# EAGLE design zOUT_fp_00a (EAGLE 6.5.0)
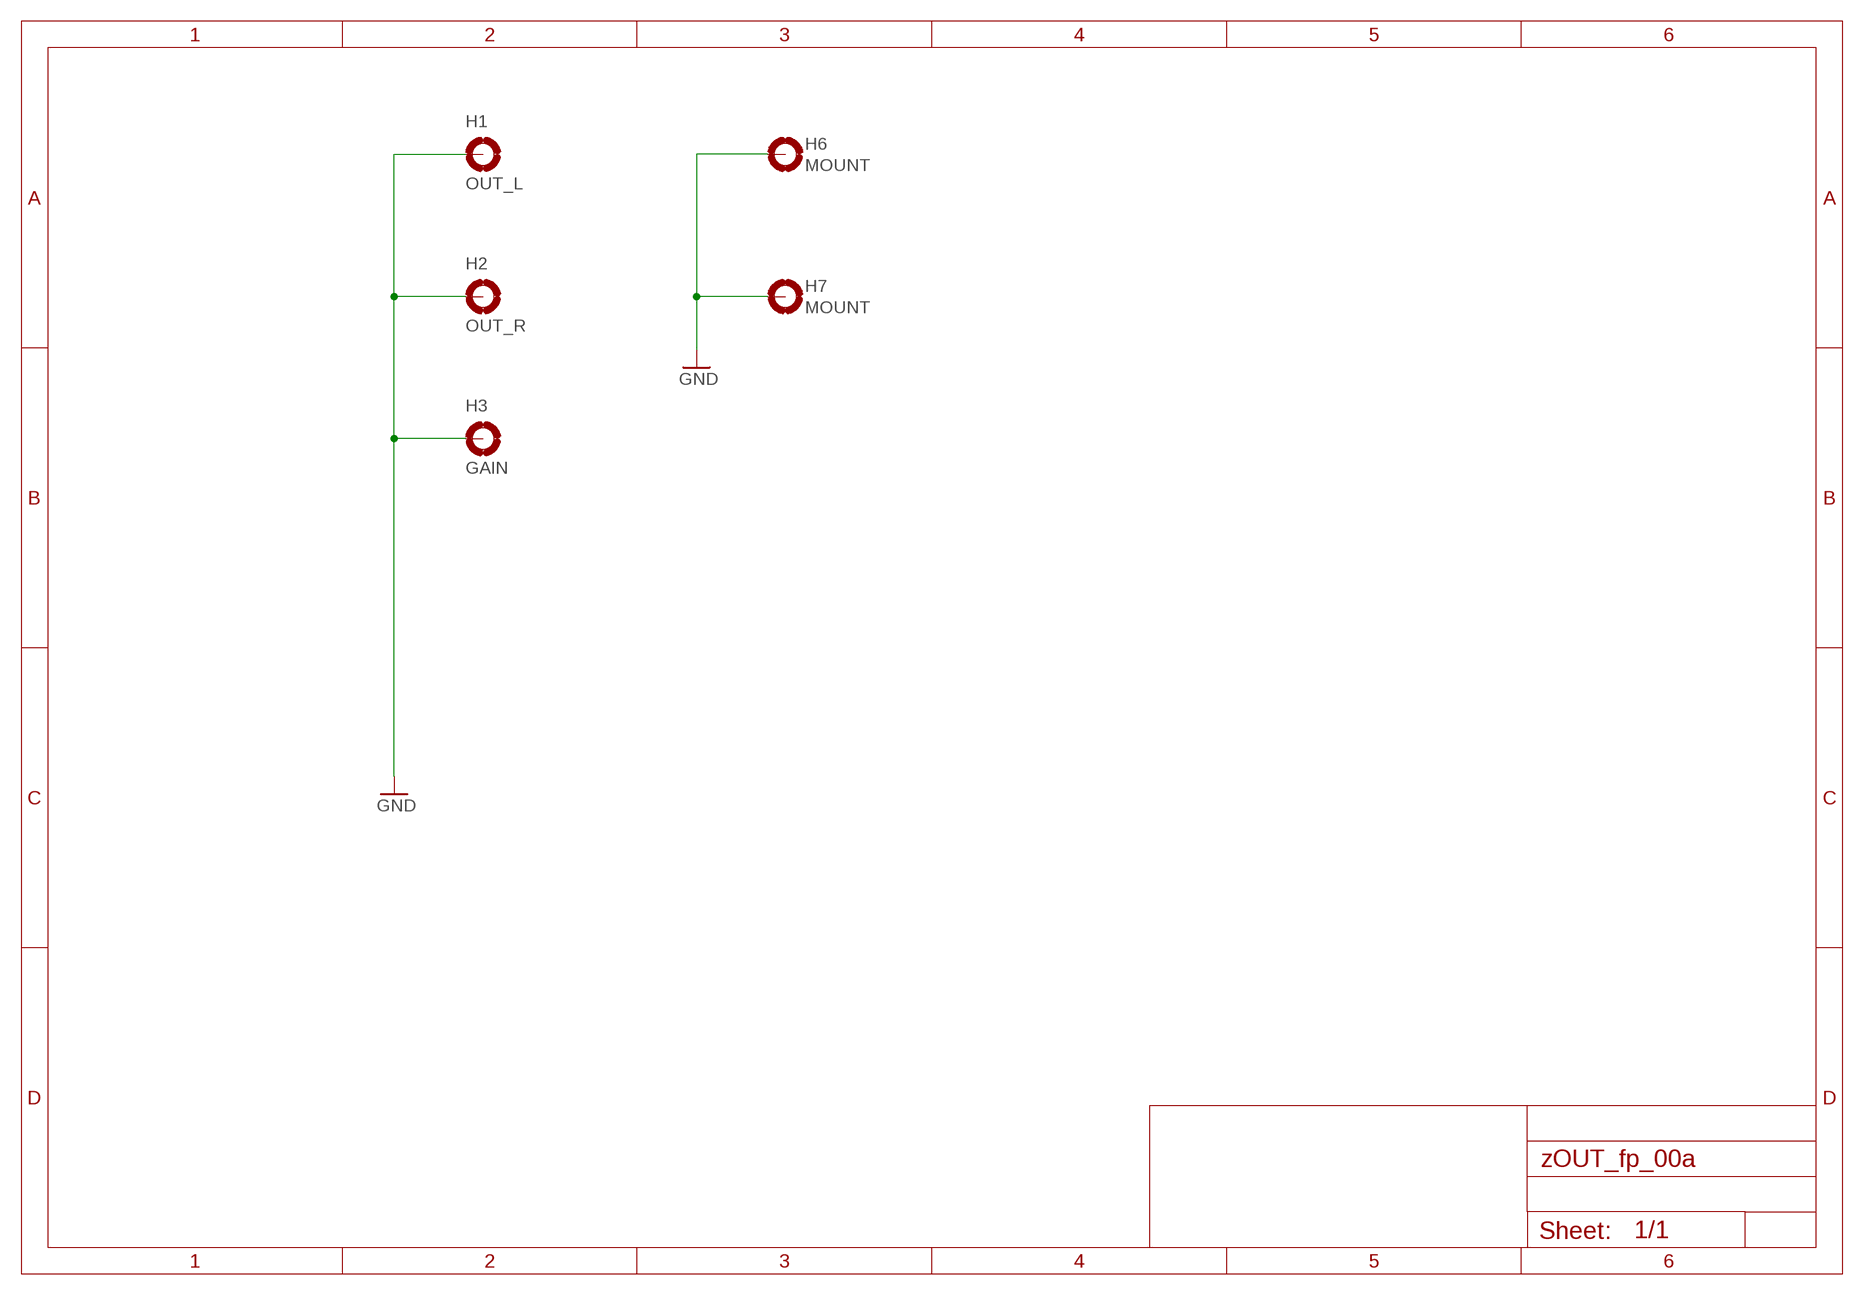
[diagram p0: schematic, sheet 1]

## Parts
H1  OUT_L  MOUNT-PAD-ROUND6.223  [6,223-PAD]
H2  OUT_R  MOUNT-PAD-ROUND6.223  [6,223-PAD]
H3  GAIN  MOUNT-PAD-ROUND7.112  [7.112-PAD]
H6  MOUNT  MOUNT-PAD-LONG3.2  [3,2-PAD_L]
H7  MOUNT  MOUNT-PAD-LONG3.2  [3,2-PAD_L]

## Nets
GND: H1.B6,223(MOUNT) H2.B6,223(MOUNT) H3.B4,5(MOUNT) H6.B3,2(MOUNT) H7.B3,2(MOUNT)

## Library data of the parts
H1-H3 = _motovilo_holes:MOUNT-PAD-ROUND: MOUNTING PAD, round
H6 H7 = _motovilo_holes:MOUNT-PAD-LONG: MOUNTING PAD, long

## Board
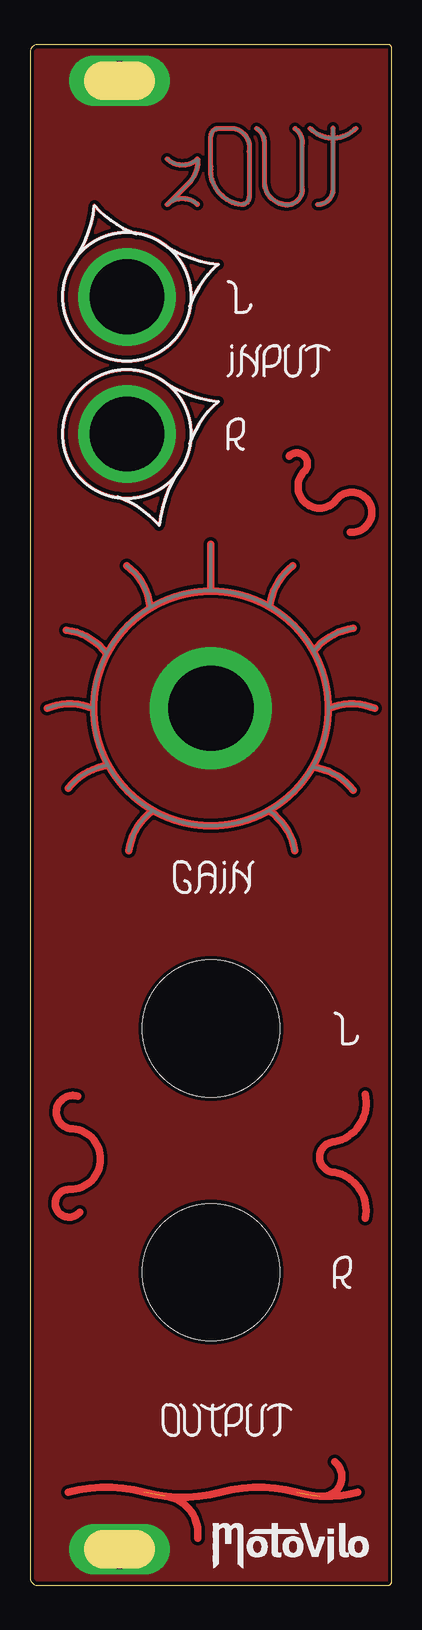
[diagram p1: board, top side]
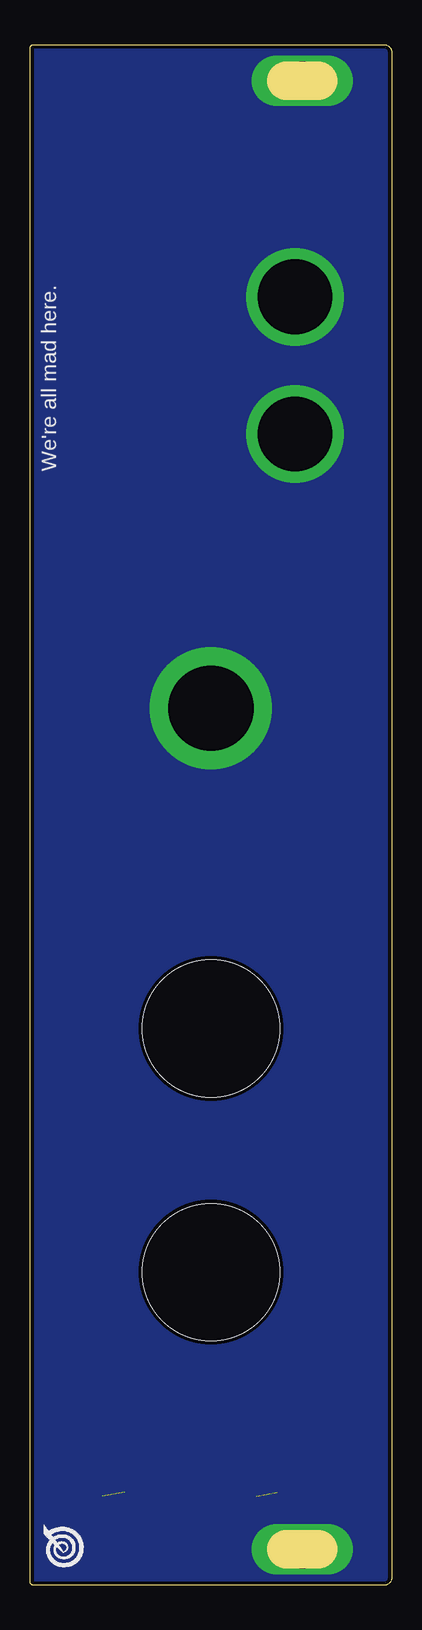
[diagram p2: board, bottom side, seen from below]

Size 30.14 x 128.4 mm. Coordinates in mm from the lower left corner, seen from the top.
Outline: 30.14,0.32 30.14,128.1 arc90 29.84,128.4 0.64,128.4 arc90 0,127.77 0,0.65 arc90 0.65,0 29.82,0 arc90 30.14,0.32
Copper layers (1*16): Top 0.035mm / dielectric 1.5mm / Bottom 0.035mm
Design rules "Motovilo Design Rules #1 *": minimum track width 10mil, minimum drill 12mil, track to track 10mil, track to pad 10mil, pad to pad 10mil, via to via 10mil, smd to smd 0mil, copper to edge 12mil, drill to drill 25mil, minimum pad ring 10mil, minimum via ring 6mil, stop-mask expansion 2mil, vias tented up to drill 100mil, thermal gap 10mil
Holes 11.43 mm at 15.07,26.1 15.07,46.42

### Footprints (pad centres in the part's own frame; a part is rotated, then mirrored left to right if it is on the bottom)
6,223-PAD = drill 6.223 pad 8.128: B6,223 0,0
7.112-PAD = drill 7.112 pad 10.16: B4,5 0,0
3,2-PAD_L = drill 3.2 pad 3.81 long: B3,2 0,0

### Placement (x,y rotation side)
E$3  [L]  16.51,106.11 0 top
E$4  [R]  16.51,94.68 0 top
E$5  [GAIN]  12.06,57.6 0 top
E$6  [SCALE-0.8M]  15.07,73.09 0 top
E$7  [L]  25.4,45.15 0 top
E$8  [R]  25.4,24.83 0 top
E$10  [INPUT]  16.51,100.78 0 top
E$11  [OUTPUT_0.1]  11.11,12.51 0 top
H1  8.07,107.38 270 top
H2  8.07,95.95 270 top
H3  15.07,73.09 270 top
H6  7.45,125.4 0 top
H7  7.45,3 0 top
U$1  [ZOUT]  11.43,115.06 0 top
U$2  [LOGO_SPACE_002A]  15.24,1.4 0 top
U$3  [LOGO_1]  25.4,1.4 90 bottom
U$5  [CATSEYE2]  8.07,107.38 270 top
U$6  [CATSEYE2]  8.07,95.95 180 top

### Tracks (layer width: path | path; a pad name or v marks a point on that pad's centre or on a via)
GND
  pour Top (isolate 0.305, no thermals): 0,128.4 30.14,128.4 30.14,0 0,0
  pour Bottom (isolate 0.305, no thermals): 0,128.4 30.14,128.4 30.14,0 0,0
N$3  (2 unrouted)
  Top 0.61: 27.3,7.75 arc-30 22.23,7.75 arc30 15.88,7.75 arc-30 9.53,7.75 arc30 3.17,7.75 | 11.27,7.43 arc-90 13.97,3.94 | 24.13,7.43 arc148 25.4,10.29
N$6
  Top 0.61: 27.94,30.61 arc90 25.4,34.42 arc-180 25.4,36.96 arc90 27.94,40.93
N$7
  Top 0.61: 4.13,31.09 arc-233 3.33,32.99 arc180 3.33,38.07 arc-186 3.97,40.77
N$8
  Top 0.61: 26.67,87.76 arc243 25.4,90.3 arc-180 22.86,92.84 arc180 21.59,94.11

### Text on the board
bPlace: We're all mad here.